# EasyEDA Pro project Restaurant table pager circular.epro, board PCB4
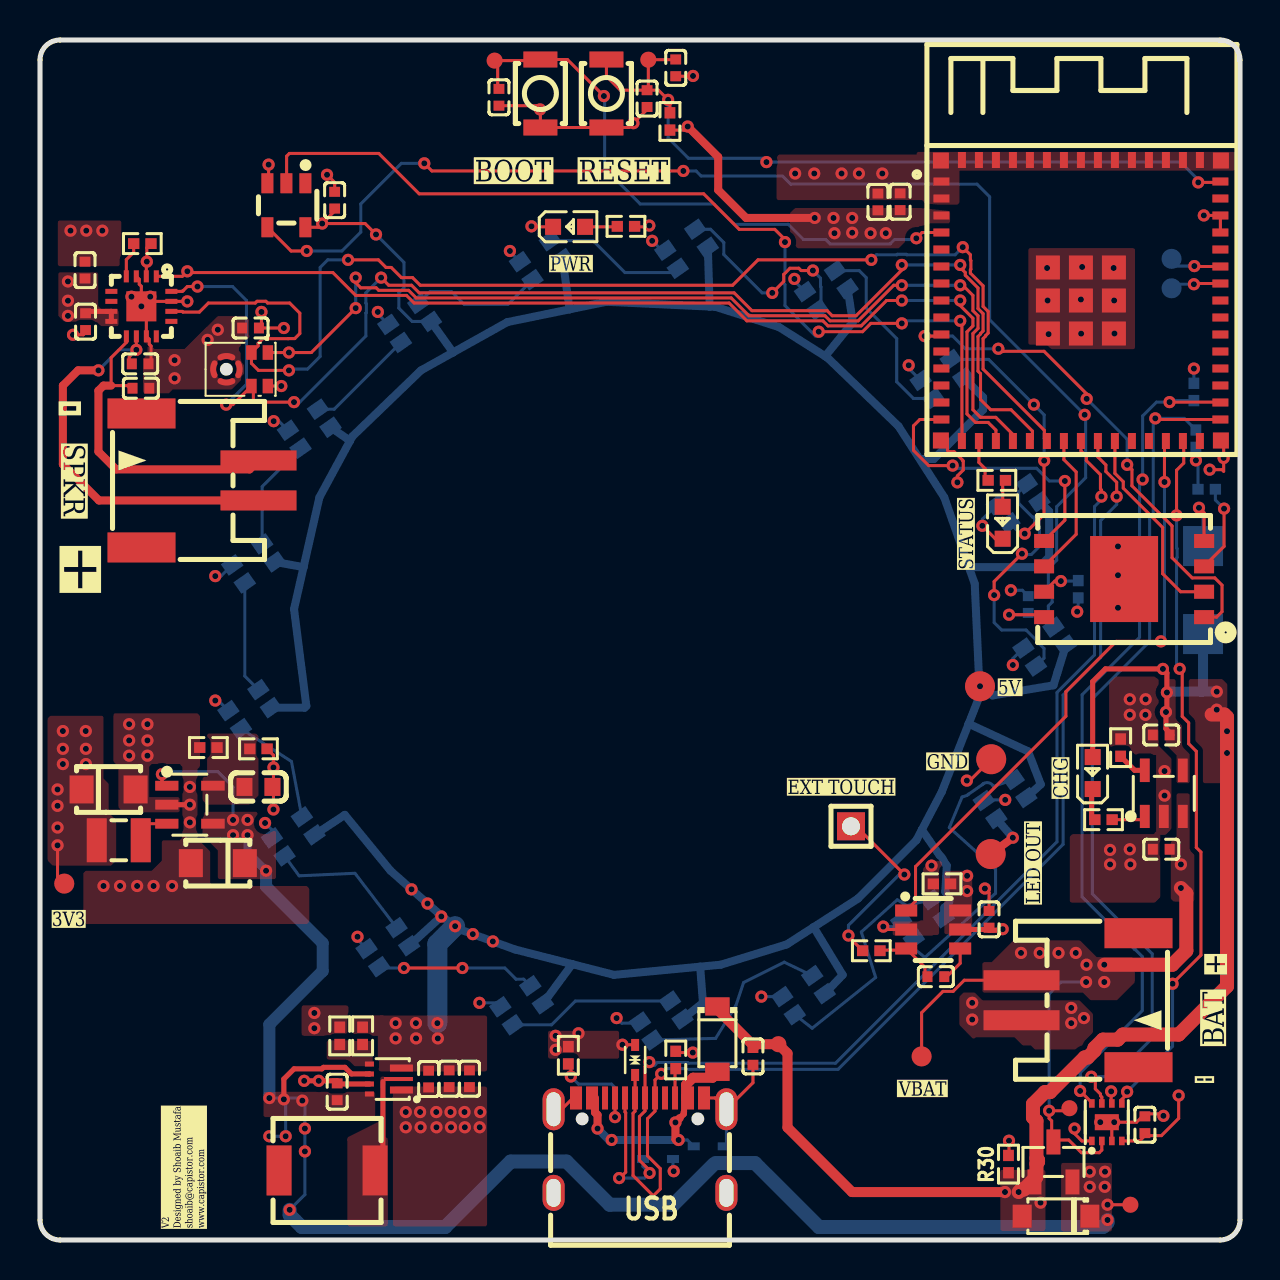
[diagram p1: board, top side]
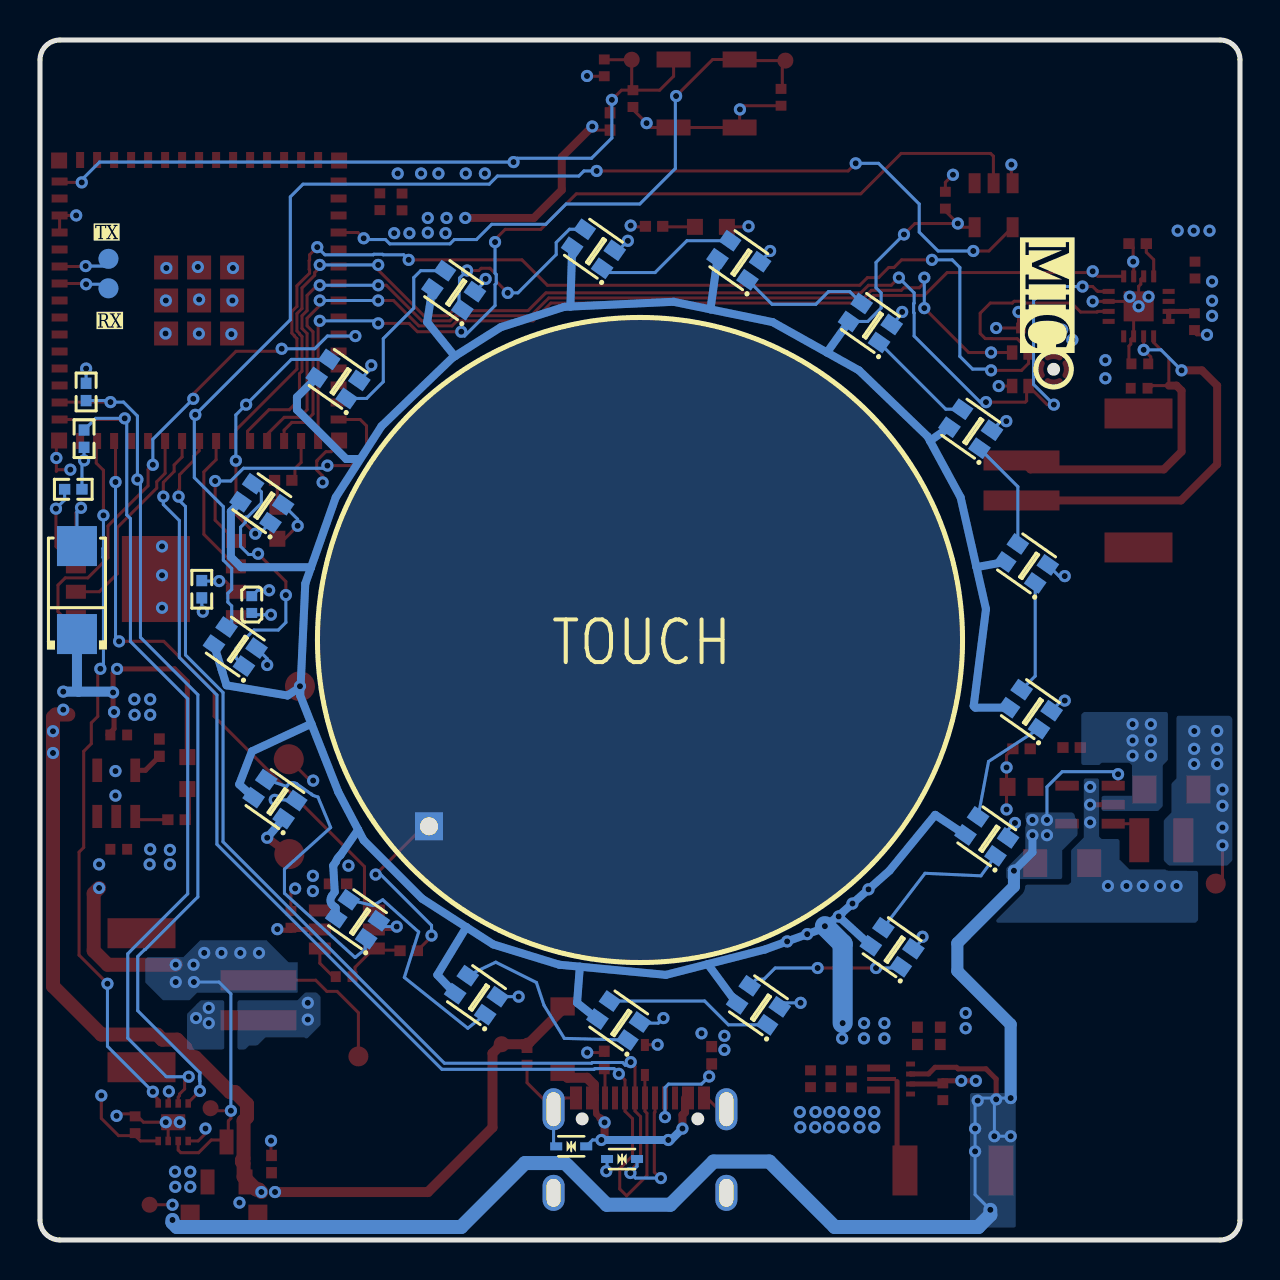
[diagram p2: board, bottom side, seen from below]

Outline 60 x 60 mm; copper layers: Top Layer, Inner1, Inner2, Bottom Layer. Coordinates in mm from the lower left corner of the outline.
Outline path: 0,59 0,1 arc(0.29,0.29) 1,0 59,0 arc(59.71,0.29) 60,1 60,59 arc(59.71,59.71) 59,60 1,60 arc(0.29,59.71) 0,59
Stack: Top Layer 0.035mm Outer layer thickness 1oz / Dielectric1 0.2104mm 7628 RC49% 8.6mil / Inner1 0.0152mm Inner layer thickness / Dielectric2 1.065mm 1.1mm H/HOZ Copper / Inner2 0.0152mm Inner layer thickness / Dielectric3 0.2104mm 7628 RC49% 8.6mil / Bottom Layer 0.035mm Outer layer thickness 1oz

## Design rules (mm)
net D-: DP1
net D+: DP1
template: Custom Config
spacing copperThickness1oz (default): track to track 0.102, other pairs 0.152 to 0.3
spacing copperThickness2oz: track to track 0.203, other pairs 0.152 to 0.3
track width copperThickness1oz (default): min 0.127, default 0.152, max 2.54
track width copperThickness2oz: min 0.203, default 0.254, max 2.54
differential pair differentialPair (default): width min 0.127, default 0.152, max 2.54; gap min 0.152, default 0.152
via viaSize (default): diameter min 0.5, default 0.61, max 10; hole min 0.3, default 0.305, max 6.3
net +5V uses copperRegion1
net $1N5564 uses copperRegion1
net $1N5430 uses copperRegion1
net $1N5433 uses copperRegion1

## Placement (name value [footprint] x y rotation side)
C1  10uF  [CAP-SMD_L3.2-W1.6]  3.43 22.53 0 top
C2  22pF  [C0603]  10.92 22.65 0 top
C3  10uF  [CAP-SMD_L3.2-W1.6]  8.89 18.84 180 top
C4  10uF  [C0402]  41.9 51.9 270 top
C7  22uF  [C0402]  19.43 8.05 270 top
C8  4.7uF  [C0402]  56.06 19.54 180 top
C9  4.7uF  [C0402]  56.06 25.25 180 top
C10  10uF  [C0402]  14.86 7.41 270 top
C12  100nF  [C0402]  14.73 51.99 270 top
C14  100nF  [C0402]  43.01 51.91 270 top
C15  100nF  [C0402]  30.35 57.07 270 top
C17  100nF  [C0402]  10.53 45.6 0 top
C18  10nF  [C0402]  44.79 13.17 180 top
C20  100nF  [C0402]  47.45 16.03 270 top
C21  100nF  [C0402]  55.24 5.76 270 top
C22  10uF  [C0402]  2.25 48.5 270 top
C23  100nF  [C0402]  2.28 45.92 90 top
C24  220pF  [C0402]  5.01 43.81 180 top
C25  220pF  [C0402]  5.04 42.59 180 top
C39  22uF  [C0402]  20.46 8.06 270 top
C40  22uF  [C0402]  21.47 8.06 270 top
C41  10uF  [C0402]  35.65 9.18 90 top
C42  1uF  [C0402]  31.79 58.61 90 top
C43  100nF  [C0402]  22.95 57.13 270 top
C44  100nF  [C0402]  49.41 31.77 90 bottom
CN1  S2B-PH-SM4-TB(LF)(SN)  [CONN-SMD_P2.00_S2B-PH-SM4-TB-LF-SN]  52 11.99 90 top
D1  B5819W  [SOD-123_L2.8-W1.8-LS3.7-RD]  50.8 1.19 180 top
D4  LESD5D5.0CT1G  [SOD-523_L1.2-W0.8-LS1.6-BI]  29.75 9 270 top
D5  LESD5D5.0CT1G  [SOD-523_L1.2-W0.8-LS1.6-BI]  30.9 4.05 180 bottom
D6  LESD5D5.0CT1G  [SOD-523_L1.2-W0.8-LS1.6-BI]  33.44 4.68 180 bottom
D7  1N5819HW-7-F  [SOD-123_L2.7-W1.6-LS3.7-RD]  33.87 10.04 270 top
D8  SMAJ5.0A  [SMA_L4.3-W2.6-LS5.1-RD]  58.15 32.5 90 bottom
DO1  -  [Test-Point-0.5mm#2]  47.53 19.3 0 top
GND1  -  [Test-Point-0.5mm#2]  47.56 24.04 0 top
H1  speaker  [CONN-SMD_P2.00_S2B-PH-SM4-TB-LF-SN]  8 37.98 270 top
H2  -  [HDR-TH_1P-V-M_XKB_X4611WV-01I-C28D40]  40.55 20.69 180 top
L1  2.2uH  [IND-SMD_L2.5-W2.0_MHCHL2520]  3.94 19.99 0 top
L2  1uH  [IND-SMD_L5.4-W5.1]  14.35 3.48 180 top
LED1  WS2812B-2020  [LED-SMD_4P-L2.0-W2.0-TL_WS2812B-2020]  48.25 22.05 35 bottom
LED2  WS2812B-2020  [LED-SMD_4P-L2.0-W2.0-TL_WS2812B-2020]  44.12 16.04 35 bottom
LED3  WS2812B-2020  [LED-SMD_4P-L2.0-W2.0-TL_WS2812B-2020]  38.18 12.24 35 bottom
LED4  WS2812B-2020  [LED-SMD_4P-L2.0-W2.0-TL_WS2812B-2020]  31.06 10.97 35 bottom
LED5  KT-0603R  [LED0603-RD]  52.63 23.35 90 top
LED6  WS2812B-2020  [LED-SMD_4P-L2.0-W2.0-TL_WS2812B-2020]  24.08 11.73 35 bottom
LED7  WS2812B-2020  [LED-SMD_4P-L2.0-W2.0-TL_WS2812B-2020]  17.39 14.64 35 bottom
LED8  WS2812B-2020  [LED-SMD_4P-L2.0-W2.0-TL_WS2812B-2020]  12.66 20.18 35 bottom
LED9  WS2812B-2020  [LED-SMD_4P-L2.0-W2.0-TL_WS2812B-2020]  10.48 26.54 35 bottom
LED10  WS2812B-2020  [LED-SMD_4P-L2.0-W2.0-TL_WS2812B-2020]  10.67 33.83 35 bottom
LED11  WS2812B-2020  [LED-SMD_4P-L2.0-W2.0-TL_WS2812B-2020]  13.46 40.56 35 bottom
LED12  WS2812B-2020  [LED-SMD_4P-L2.0-W2.0-TL_WS2812B-2020]  18.48 45.85 35 bottom
LED13  WS2812B-2020  [LED-SMD_4P-L2.0-W2.0-TL_WS2812B-2020]  25.06 48.99 35 bottom
LED14  WS2812B-2020  [LED-SMD_4P-L2.0-W2.0-TL_WS2812B-2020]  32.33 49.56 35 bottom
LED15  WS2812B-2020  [LED-SMD_4P-L2.0-W2.0-TL_WS2812B-2020]  39.32 47.49 35 bottom
LED16  KT-0603R  [LED0603-RD]  48.13 35.86 90 top
LED17  WS2812B-2020  [LED-SMD_4P-L2.0-W2.0-TL_WS2812B-2020]  45.1 43.05 35 bottom
LED18  WS2812B-2020  [LED-SMD_4P-L2.0-W2.0-TL_WS2812B-2020]  48.91 36.84 35 bottom
LED19  WS2812B-2020  [LED-SMD_4P-L2.0-W2.0-TL_WS2812B-2020]  50.24 29.67 35 bottom
LED21  KT-0603R  [LED0603-RD]  26.45 50.66 0 top
Q1  DMG3415U  [SOT-23-3_L2.9-W1.3-P1.90-LS2.4-BR-1]  50.67 3.9 270 top
R2  100kΩ  [R0402]  10.92 24.56 0 top
R13  732kΩ  [R0402]  16.13 10.21 90 top
R14  100kΩ  [R0402]  14.99 10.21 270 top
R17  10kΩ  [R0402]  57.69 42.4 90 bottom
R18  10kΩ  [R0402]  57.8 40.07 270 bottom
R19  5.1kΩ  [R0402]  31.79 9 270 top
R20  5.1kΩ  [R0402]  26.42 9.24 270 top
R21  10kΩ  [R0402]  31.5 55.93 270 top
R24  10kΩ  [R0402]  41.57 14.46 180 top
R27  0Ω  [R0402]  45.1 17.81 180 top
R28  1kΩ  [R0402]  54.03 24.62 90 top
R30  10kΩ  [R0402]  48.42 3.79 90 top
R32  22.1kΩ  [R0402]  8.42 24.62 180 top
R35  1MΩ  [R0402]  5.12 49.82 180 top
R38  140Ω  [R0402]  53.17 21.02 0 top
R39  140Ω  [R0402]  29.3 50.68 180 top
R40  140Ω  [R0402]  47.84 37.98 0 top
R41  10kΩ  [R0402]  51.91 32.54 90 bottom
R42  10kΩ  [R0402]  58.34 37.54 0 bottom
SW1  B3U-1000P  [KEY-SMD_B3U-1000PM]  28.32 57.32 90 top
SW2  B3U-1000P  [KEY-SMD_B3U-1000PM]  25.02 57.32 90 top
TP1  -  [Test-Point-0.5mm#2]  47 27.69 0 top
TP3  -  [Test-Point-0.5mm]  56.58 47.58 180 bottom
TP4  -  [Test-Point-0.5mm#3]  22.73 58.97 0 top
TP5  -  [Test-Point-0.5mm#3]  30.42 59.01 0 top
TP6  -  [Test-Point-0.5mm#3]  54.52 1.76 0 top
TP7  -  [Test-Point-0.5mm#3]  36.92 9.79 0 top
TP8  -  [Test-Point-0.5mm#3]  51.47 6.59 0 top
TP9  -  [Test-Point-0.5mm]  1.21 17.82 0 top
TP10  -  [Test-Point-0.5mm]  56.58 49.06 180 bottom
TP11  -  [Test-Point-0.5mm]  44.08 9.18 0 top
U1  SY8088IAAC  [SOT-23-5_L3.0-W1.7-P0.95-LS2.8-BL]  7.49 21.76 270 top
U3  MCP73831T-2ACI/OT  [SOT-23-5_L3.0-W1.7-P0.95-LS2.8-BL]  56.19 22.33 0 top
U4  TPS61022RWUR  [VQFN-7_L2.0-W2.0-P0.55-TL_RWU]  17.27 8.05 180 top
U5  ESP32-S3-MINI-1-N4R2  [BULETM-SMD_ESP32-S3-MINI-1-N8]  52.04 46.97 0 top
U6  SN74LV1T34DBVR  [SOT-23-5_L2.9-W1.6-P0.95-LS2.8-BR_2]  12.32 51.74 90 top
U7  MAX98357AETE+T  [TQFN-16_L3.0-W3.0-P0.50-BL-EP1.5]  5.07 46.68 180 top
U8  SPH0655LM4H-1-8  [MIC-SMD_SPH0655LM4H-1-8]  10.02 43.54 270 top
U9  MAX17048G+T10  [TDFN-8_L2.0-W2.0-P0.50-BL-EP1.2]  53.34 5.89 0 top
U10  AT42QT1011-TSHR  [SOT-23-6_L2.9-W1.6-P0.95-LS2.8-BR]  44.66 15.53 180 top
U12  MX35LF1GE4AB-Z4ITR  [WSON-8_L8.0-W6.0-P1.27-TL-1]  54.2 33.05 180 top
USB1  USB4105-GF-A  [TYPE-C-SMD_SBC-160S1A-20-S412]  30 4.73 0 top

## Footprints (pads in the part's own frame, mm; a bottom-side part is the same pattern mirrored in y, then rotated)
BULETM-SMD_ESP32-S3-MINI-1-N8
  rect 0.8x0.4 smd: 1(-6.975,5.95) 2(-6.975,5.1) 3(-6.975,4.25) 4(-6.975,3.4) 5(-6.975,2.55) 6(-6.975,1.7) 7(-6.975,0.85) 8(-6.975,0) 9(-6.975,-0.85) 10(-6.975,-1.7) 11(-6.975,-2.55) 12(-6.975,-3.4) 13(-6.975,-4.25) 14(-6.975,-5.1) 15(-6.975,-5.95) 31(6.975,-5.95) 32(6.975,-5.1) 33(6.975,-4.25) 34(6.975,-3.4) 35(6.975,-2.55) 36(6.975,-1.7) 37(6.975,-0.85) 38(6.975,0) 39(6.975,0.85) 40(6.975,1.7) 41(6.975,2.55) 42(6.975,3.4) 43(6.975,4.25) 44(6.975,5.1) 45(6.975,5.95)
  rect 0.4x0.8 smd: 16(-5.95,-7.025) 17(-5.1,-7.025) 18(-4.25,-7.025) 19(-3.4,-7.025) 20(-2.55,-7.025) 21(-1.7,-7.025) 22(-0.85,-7.025) 23(0,-7.025) 24(0.85,-7.025) 25(1.7,-7.025) 26(2.55,-7.025) 27(3.4,-7.025) 28(4.25,-7.025) 29(5.1,-7.025) 30(5.95,-7.025) 46(5.95,7.025) 47(5.1,7.025) 48(4.25,7.025) 49(3.4,7.025) 50(2.55,7.025) 51(1.7,7.025) 52(0.85,7.025) 53(0,7.025) 54(-0.85,7.025) 55(-1.7,7.025) 56(-2.55,7.025) 57(-3.4,7.025) 58(-4.25,7.025) 59(-5.1,7.025) 60(-5.95,7.025)
  rect 0.8x0.8 smd: GND(-7,7) GND(-7,-7) GND(7,7) GND(7,-7)
  rect 1.2x1.2 smd: GND(-1.65,1.65) GND(-1.65,0) GND(-1.65,-1.65) GND(0,1.65) GND(0,0) GND(0,-1.65) GND(1.65,1.65) GND(1.65,0) GND(1.65,-1.65)
C0402
  rect 0.5x0.54 smd: 1(-0.42,0) 2(0.42,0)
C0603
  rect 0.8x0.9 smd: 1(-0.7,0) 2(0.7,0)
CAP-SMD_L3.2-W1.6
  rect 1.2x1.4 smd: 1(-1.35,0) 2(1.35,0)
CONN-SMD_P2.00_S2B-PH-SM4-TB-LF-SN
  rect 1x3.8 smd: 1(-1,2.925) 2(1,2.925)
  rect 1.5x3.4 smd: 3(3.35,-2.925) 4(-3.35,-2.925)
HDR-TH_1P-V-M_XKB_X4611WV-01I-C28D40
  rect 1.4x1.4 hole 0.9: 1(0,0)
IND-SMD_L2.5-W2.0_MHCHL2520
  rect 1x2.2 smd: 1(-1.1,0) 2(1.1,0)
IND-SMD_L5.4-W5.1
  rect 1.25x2.5 smd: 1(-2.4,0) 2(2.4,0)
KEY-SMD_B3U-1000PM
  rect 0.8x1.7 smd: 1(-1.7,0) 2(1.7,0)
LED0603-RD
  rect 0.8x0.8 smd: 1(-0.799,0) 2(0.799,0)
LED-SMD_4P-L2.0-W2.0-TL_WS2812B-2020
  rect 0.9x0.7 smd: 1(-0.915,0.55) 2(-0.915,-0.55) 3(0.915,-0.55) 4(0.915,0.55)
MIC-SMD_SPH0655LM4H-1-8
  rect 0.725x0.522 smd: 1(-0.838,1.368) 2(-0.838,0.546) 4(0.838,0.546) 5(0.838,1.368)
  custom 0.37x0.892 smd: 3(-0.662,-0.706)
  custom 0.892x0.37 smd: 3(0,-0.043) 3(0,-1.368)
  custom 0.37x0.893 smd: 3(0.662,-0.706)
R0402
  rect 0.566x0.54 smd: 1(-0.433,0) 2(0.433,0)
SMA_L4.3-W2.6-LS5.1-RD
  rect 2x2 smd: 1(-2.2,0) 2(2.2,0)
SOD-123_L2.7-W1.6-LS3.7-RD
  rect 0.91x1.22 smd: 1(-1.635,0) 2(1.635,0)
SOD-123_L2.8-W1.8-LS3.7-RD
  rect 0.95x1.15 smd: 1(-1.692,0) 2(1.692,0)
SOD-523_L1.2-W0.8-LS1.6-BI
  rect 0.6x0.4 smd: 1(-0.75,0) 2(0.75,0)
SOT-23-3_L2.9-W1.3-P1.90-LS2.4-BR-1
  rect 1.25x0.7 smd: 1(1,-0.95) 2(1,0.95) 3(-1,0)
SOT-23-5_L2.9-W1.6-P0.95-LS2.8-BR_2
  rect 1x0.6 smd: 1(1.1,-0.95) 2(1.1,0) 3(1.1,0.95) 4(-1.1,0.95) 5(-1.1,-0.95)
SOT-23-5_L3.0-W1.7-P0.95-LS2.8-BL
  rect 0.49x1.157 smd: 1(-0.95,-1.153) 2(0,-1.153) 3(0.95,-1.153)
  rect 0.49x1.175 smd: 4(0.95,1.153) 5(-0.95,1.153)
SOT-23-6_L2.9-W1.6-P0.95-LS2.8-BR
  rect 1.1x0.6 smd: 1(1.35,-0.95) 2(1.35,0) 3(1.35,0.95) 4(-1.35,0.95) 5(-1.35,0) 6(-1.35,-0.95)
TDFN-8_L2.0-W2.0-P0.50-BL-EP1.2
  rect 0.28x0.425 smd: 1(-0.75,-0.938) 2(-0.25,-0.938) 3(0.25,-0.938) 4(0.75,-0.938) 5(0.75,0.938) 6(0.25,0.938) 7(-0.25,0.938) 8(-0.75,0.938)
  rect 1.2x0.8 smd: 9(0,0)
Test-Point-0.5mm
  round 1 smd: 1(0,0)
Test-Point-0.5mm#2
  round 1.5 smd: 1(0,0)
Test-Point-0.5mm#3
  round 0.8 smd: 1(0,0)
TQFN-16_L3.0-W3.0-P0.50-BL-EP1.5
  rect 0.25x0.6 smd: 1(-0.749,-1.5) 2(-0.248,-1.5) 3(0.252,-1.5) 4(0.751,-1.5) 9(0.75,1.5) 10(0.25,1.5) 11(-0.25,1.5) 12(-0.749,1.5)
  rect 0.6x0.25 smd: 5(1.5,-0.748) 6(1.5,-0.248) 7(1.5,0.252) 8(1.5,0.752) 13(-1.5,0.752) 14(-1.5,0.252) 15(-1.5,-0.248) 16(-1.5,-0.748)
  rect 1.5x1.5 smd: 17(0,0)
TYPE-C-SMD_SBC-160S1A-20-S412
  oval 1.1x2.1 hole 0.7x1.7: 1(-4.32,1.807) 1(4.32,1.807)
  oval 1.1x1.8 hole 0.7x1.4: 1(-4.32,-2.373) 1(4.32,-2.373)
  rect 0.3x1.15 smd: A1(-3.35,2.372) A4(-2.55,2.372) A5(-1.25,2.372) A6(-0.25,2.372) A7(0.25,2.372) A8(1.25,2.373) A9(2.55,2.373) A12(3.35,2.372) B1(3.05,2.372) B4(2.25,2.373) B5(1.75,2.372) B6(0.75,2.372) B7(-0.75,2.372) B8(-1.75,2.373) B9(-2.25,2.372) B12(-3.05,2.372)
VQFN-7_L2.0-W2.0-P0.55-TL_RWU
  rect 1.15x0.35 smd: 1(-0.8,0.55) 3(-0.8,-0.55)
  rect 1.45x0.2 smd: 2(-0.65,0)
  rect 0.45x0.25 smd: 4(0.8,-0.75) 5(0.8,-0.25) 6(0.8,0.25) 7(0.8,0.75)
WSON-8_L8.0-W6.0-P1.27-TL-1
  rect 1x0.7 smd: 1(-4,1.905) 2(-4,0.635) 3(-4,-0.635) 4(-4,-1.905) 5(4,-1.905) 6(4,-0.635) 7(4,0.635) 8(4,1.905)
  rect 3.4x4.3 smd: 9(0,0)

## Nets
As in the schematic, except:
GND: C1.2 C3.2 C4.1 C7.2 C8.2 C9.2 C10.1 C12.1 C14.1 C15.2 C17.1 C20.1 C21.2 C22.1 C23.1 C24.1 C25.1 C39.2 C40.2 C41.1 C42.1 C43.2 C44.2 CN1.1 D4.1 D5.1 D6.1 D8.2 GND1.1 LED1.2 LED2.2 LED3.2 LED4.2 LED6.2 LED7.2 LED8.2 LED9.2 LED10.2 LED11.2 LED12.2 LED13.2 LED14.2 LED15.2 LED16.1 LED17.2 LED18.2 LED19.2 LED21.1 R14.1 R19.1 R20.1 R27.2 R28.2 R30.2 R32.2 SW1.1 SW2.1 U1.2 U3.2 U4.1 U4.6 U5.1 U5.2 U5.42 U5.43 U5.46 U5.47 U5.48 U5.49 U5.50 U5.51 U5.52 U5.53 U5.54 U5.55 U5.56 U5.57 U5.58 U5.59 U5.60 U5.GND U6.3 U7.3 U7.11 U7.15 U7.17 U8.3 U9.1 U9.4 U9.6 U10.2 U12.4 U12.9 USB1.1 USB1.A1 USB1.A12 USB1.B1 USB1.B12
CC1: R20.2 USB1.A5
CC2: R19.2 USB1.B5
D+: D4.2 U5.24 USB1.A6 USB1.B6
D-: D5.2 U5.23 USB1.A7 USB1.B7
$1N5565: D6.2 D7.2 USB1.A4 USB1.A9 USB1.B4 USB1.B9

Pads without a net: CN1 3 4; H1 3 4; U5 5 6 7 8 9 11 12 13 14 26 27 30 33 34 35 36 37 38 41 44; U6 1; U7 5 6 12 13; USB1 A8 B8

## Via types
v1: diameter 0.61, hole 0.305, Top Layer to Bottom Layer, 288 vias

## Routing (per net, layer and track width the routed paths; a pad name or vN(x,y) marks a point on that pad's centre or on a via; arc(x,y) is an arc through that point)
3V3: length 34.4
  Top Layer w0.152: U9.3 53.59,5.64 U9.9 ; U8.5 v1(12.07,42.7) ; R35.1 5.34,49.61 v1(5.34,48.92) 5.32,48.89 U7.2 ; R2.2 11.67,24.24 v1(11.67,23.63) 11.67,22.6 ; 29.81,50.66 30.4,50.66 v1(30.47,50.72) ; v1(56.17,6.21) 56.07,6.31 55.24,6.31 54.83,5.89 v1(53.71,5.89) ; U12.8 50.08,31.26 v1(48.45,31.26) ; v1(12.19,45.6) 11.07,45.6 v1(11.07,46.4) ; R21.2 32.21,55.49 v1(32.39,55.67) ; 0.91,17.87 0.88,17.9 v1(0.88,19.73) ; 11.67,22.6 C2.2 ; 11.67,22.6 v1(11.67,21.53)
  Top Layer w0.254: v1(48.13,15.54) 48.08,15.49 47.45,15.49 47.42,15.53 U10.5 ; U7.8 U7.7 2.37,46.43 C23.2
  Top Layer w0.4: v1(32.39,55.67) 33.91,54.15 33.91,52.5 35.31,51.1 v1(38.73,51.1)
  Bottom Layer w0.152: C44.1 49.32,31.26 v1(48.45,31.26) ; R18.2 v1(57.8,38.98) 57.9,38.87 R42.1 ; R17.2 v1(57.69,43.57) ; v1(51.86,31.42) 51.91,31.47 R41.1
  vias: v1(0.88,22.53) v1(0.88,21.71) v1(0.88,20.62) v1(1.14,25.45) v1(1.14,24.56) v1(1.14,23.8) v1(1.4,47.93) v1(1.4,46.96) v1(1.4,46.21) v1(2.29,25.45) v1(2.29,24.56) v1(2.29,23.8) v1(39.67,51.1) v1(39.72,50.34) v1(40.61,51.1) v1(40.61,50.36) v1(41.53,50.34) v1(42.29,50.34) v1(46.36,18.21) v1(46.36,17.45) v1(53.01,5.89)
+5V: length 177.5
  Top Layer w0.152: U6.5 13.92,50.64 v1(14.11,50.82) ; v1(14.11,50.82) 14.73,51.45 ; v1(14.11,50.82) 16.25,50.82 v1(16.8,50.28)
  Bottom Layer w0.152: LED12.4 18.61,45.93 17.94,46.59 17.94,47.36 18.2,47.61 18.2,48.88 v1(16.8,50.28) ; 44.11,39.05 44.09,39.07
  Bottom Layer w0.4: 39.26,44.19 40.64,45.89 40.38,47.57 ; 39.26,44.19 39.37,44.12 42.93,40.69 45.21,37.13 46.45,33.62 ; 39.26,44.19 36.96,45.64 33.78,46.66 33.48,46.67 ; 26.61,13.79 28.7,13.26 33.01,13.67 ; 26.61,13.79 LED6.4 ; 26.61,13.79 23.75,14.53 v1(22.64,14.93) v1(21.64,15.29) 20.95,15.54 v1(20.76,15.69) 20.12,16.17 ; LED4.4 33.15,11.86 33.01,13.67 ; 46.45,33.62 46.47,33.64 49.95,33.64 50.46,34.15 50.46,36.43 LED18.4 ; 46.45,33.62 46.74,32.81 46.97,27.65 ; 44.09,20.51 45.08,22.4 46.43,25.81 ; 44.09,20.51 44.98,19.24 arc(45.12,19.09) 45.2,18.91 45.34,18.72 45.26,17.41 45.42,17.19 arc(45.47,16.93) 45.33,16.7 45.22,16.62 LED2.4 ; 44.09,20.51 43.82,19.99 40.89,17.07 38.68,15.64 ; 13.18,33.64 13.97,37.13 15.5,39.96 ; 13.18,33.64 12.7,31.54 13.32,26.7 13.23,26.62 11.55,26.62 ; 13.18,33.64 LED10.4 ; 20.65,44.38 23.37,45.89 26.48,46.53 ; 20.65,44.38 19.05,43.48 15.62,40.18 15.5,39.96 ; 20.65,44.38 LED12.4 ; 33.01,13.67 34.04,13.76 37.34,14.78 38.68,15.64 ; 46.43,25.81 49.4,24.43 50.04,22.78 LED1.4 ; 46.43,25.81 46.99,27.23 46.97,27.65 ; 20.12,16.17 19.91,16.32 v1(20.07,16.18) 18.46,14.71 ; 20.12,16.17 v1(19.38,16.82) v1(18.58,17.53) 17.53,18.46 15.24,21.26 LED8.4 ; 38.68,15.64 40.13,13.26 LED3.4 ; 33.48,46.67 28.32,46.91 26.48,46.53 ; 33.48,46.67 33.39,49.64 ; 46.97,27.65 47.63,27.23 50.67,27.73 50.87,28.36 arc(50.89,28.44) 50.92,28.51 51.3,29.75 ; 44.11,39.05 44.69,39.05 47.15,41.51 47.15,42.14 LED17.4 ; 14.53,40.64 15.5,39.96 ; 26.48,46.53 LED13.4
  Bottom Layer w1: v1(20.76,15.69) 19.87,14.8 v1(19.87,10.84)
  vias: v1(17.78,10.84) v1(17.78,10.08) v1(18.8,10.84) v1(18.8,10.08) v1(19.89,10.08) v1(47,27.69)
GND: length 74.8
  Top Layer w0.152: USB1.A1 26.08,6.54 USB1.1 ; 2.28,45.37 2.16,45.26 v1(1.65,45.26) ; D4.1 29.74,9.76 v1(29.12,9.76) ; 35.65,8.76 35.65,7.86 USB1.1 33.75,7.1 USB1.A12 ; v1(57.95,36.61) 58.2,36.36 U12.4 ; LED16.1 47.76,35.06 v1(47.12,35.71) ; v1(56.93,7.22) 56.93,6.08 56.07,5.22 55.24,5.22 54.98,4.95 U9.4 ; v1(14.35,53.26) 14.73,52.88 14.73,52.54 ; v1(7.37,46.93) U7.15 5.75,46.93 v1(5.51,47.16) ; v1(58.19,51.23) 59.02,51.23 U5.43 U5.42 ; v1(53.56,7.43) 53.56,6.86 U9.6 ; v1(24.57,50.68) 24.6,50.66 LED21.1 ; C42.1 32.64,58.19 v1(32.65,58.2) ; U10.2 42.31,15.53 v1(42.16,15.67) ; U5.GND 59.18,39.84 v1(59.18,39.1) 59.18,38.44 59.1,38.52 v1(58.48,38.52) ; U7.3 4.96,48.04 4.96,47.79 5.07,47.68 U7.17 5.32,46.43 U7.11 5.46,45.04 5.46,44.79 5.55,44.7 5.55,43.81 ; U6.3 11.43,52.9 v1(11.43,53.77) ; U9.1 52.09,4.95 51.73,5.32 v1(51.73,5.57) ; v1(48.45,4.96) 48.45,4.25 R30.2 ; v1(47.24,17.57) 47.45,17.37 47.45,16.58 ; U5.GND 45.04,40.08 45.12,40.15 45.27,40.15 45.38,40.04 45.38,39.48 45.44,39.42 45.7,39.42 46.14,38.98 46.14,38.97 46.16,38.94 46.16,38.5 45.87,38.21 v1(45.87,37.88) ; GND1.1 46.49,22.97 v1(46.34,22.97) ; v1(32.64,9.37) 31.88,9.37 31.75,9.24 ; C43.2 24.82,56.71 v1(25,56.53) 25.02,56.51 SW2.1 SW1.1 29.45,55.62 v1(29.67,55.84) 30.35,56.53
  Top Layer w0.254: U4.6 15.02,7.8 14.86,7.96 v1(13.94,7.96) v1(13.21,7.96) ; 6.34,21.76 v1(7.49,21.76)
  Bottom Layer w0.152: v1(30.61,49.96) 31.08,49.49 31.26,49.49 ; LED12.2 16.89,46.3 v1(16.89,46.4) ; v1(37.72,48.05) 37.72,47.95 LED15.2 ; LED17.2 43.43,43.58 v1(43.43,43.74) ; C44.2 49.12,32.49 v1(48.54,32.49) ; v1(48.64,28.75) 48.64,29.07 LED19.2 ; 16.33,14.56 15.88,15.02 v1(15.88,15.16) ; LED3.2 v1(36.07,12.17) ; LED13.2 23.49,49.42 v1(23.49,49.45) ; v1(8.76,26.97) 8.91,26.97 9.42,26.47 ; v1(21.97,11.86) 22.82,11.86 LED6.2 ; LED18.2 47.12,36.04 v1(47.12,35.71) ; 12.4,40.49 11.95,40.94 v1(11.68,40.94) ; v1(8.76,33.19) 9.05,33.19 LED10.2 ; LED2.2 42.76,15.67 v1(42.16,15.67) ; LED4.2 29.94,10.84 29.08,10.84 v1(28.83,11.1) ; D6.1 34.32,4.82 USB1.1 ; D8.2 58.15,36.41 v1(57.95,36.61) ; v1(11.25,20.85) 11.6,20.51 LED8.2 ; D5.1 31.65,3.48 v1(31.69,3.44) ; v1(48.26,22.01) 47.22,22.01 LED1.2
  vias: v1(1.52,50.47) v1(2.31,50.47) v1(3.12,50.47) v1(3.17,17.7) v1(4,17.7) v1(4.46,25.79) v1(4.46,24.98) v1(4.46,24.22) v1(4.57,47.16) v1(4.86,17.7) v1(5.07,46.68) v1(5.37,25.79) v1(5.37,24.98) v1(5.37,24.22) v1(5.68,17.7) v1(6.6,17.7) v1(6.73,43.99) v1(6.73,43.09) v1(7.49,22.65) v1(7.49,20.88) v1(8.38,45.01) v1(8.89,45.51) v1(13.72,11.35) v1(13.72,10.59) v1(18.29,6.4) v1(18.29,5.64) v1(19,6.4) v1(19.03,5.64) v1(19.81,6.4) v1(19.82,5.64) v1(20.52,6.4) v1(20.55,5.64) v1(21.23,6.4) v1(21.24,5.64) v1(22.01,6.4) v1(21.98,5.64) v1(25.78,10.21) v1(25.78,9.51) v1(26.92,10.33) v1(37.76,53.32) v1(38.71,53.32) v1(40.08,53.32) v1(40.95,53.32) v1(42.11,53.32) v1(44.58,18.72) v1(46.61,11.86) v1(46.61,11.02) v1(50.35,48.6) v1(50.38,46.97) v1(50.43,45.29) v1(51.56,11.6) v1(51.56,10.84) v1(52.04,47.03) v1(52.06,45.32) v1(52.11,48.65) v1(52.2,11.1) v1(53.5,19.51) v1(53.5,18.78) v1(53.68,48.6) v1(53.71,46.97) v1(53.72,45.32) v1(53.9,34.68) v1(53.9,33.24) v1(53.9,31.61) v1(54.49,27.04) v1(54.49,26.26) v1(54.49,19.54) v1(54.52,18.78) v1(55.28,27.04) v1(55.27,26.26) v1(56.23,23.45) v1(56.23,22.22)
VBAT: length 29.4
  Top Layer w0.152: Q1.3 50.58,4.99 50.58,5.95 50.46,6.08 v1(50.46,6.46) 51.34,6.46 TP8.1 ; TP11.1 44.08,11.36 45.15,12.43 45.66,12.43 46.21,12.99 CN1.2 ; 50.67,5.16 50.83,5 51.44,5 52.07,4.37 52.96,4.37 53.09,4.5 U9.2
  Top Layer w0.7: v1(57.04,17.6) 57.32,17.33 57.32,14.46 56.62,13.76 v1(53.21,13.76)
  Bottom Layer w0.152: v1(52.3,12.9) 51.05,12.9 50.46,12.3 v1(50.46,6.46)
  vias: v1(49.05,14.35) v1(49.98,14.35) v1(50.93,14.35) v1(51.79,14.35) v1(52.32,13.76) v1(53.21,12.9) v1(57.04,18.78)
VBUS: length 68.4
  Top Layer w0.254: LED5.2 52.63,27.92 53.27,28.55 v1(56.15,28.55) 56.35,28.35 v1(56.35,27.38) 56.35,26.45 v1(56.3,26.4) 56.3,25.56 56.61,25.25
  Top Layer w0.5: 35.65,9.86 35.53,9.86 33.87,11.53 ; C41.2 35.84,9.79 TP7.1 37.37,9.33 37.37,5.62 40.6,2.4 v1(48.25,2.4)
  Top Layer w0.7: v1(48.93,2.4) 49.06,2.53 49.19,2.53 49.82,3.16 49.82,3.83 49.9,3.91 49.9,3.99 49.82,4.07 49.82,5.96 49.65,6.13 49.65,6.8 50.25,7.4 50.5,7.4 52.23,9.13 52.38,9.13 52.72,9.47 52.72,9.6 53.14,10.02 53.88,10.02 54.14,10.27 56.93,10.27 59.35,12.69 v1(59.35,24.35) v1(59.35,25.44) 59.35,26.14 59.22,26.27 58.58,26.27
  Bottom Layer w0.5: 58.07,27.42 56.39,27.42 v1(56.35,27.38) ; 58.07,27.42 58.15,27.5 D8.1 ; 58.07,27.42 v1(58.84,27.42)
  vias: v1(50.03,1.87) v1(58.84,26.51)
BM_ALRT: length 35.5
  Top Layer w0.152: v1(56.83,36.23) 56.83,38.49 57.19,38.85 57.19,39.91 U5.29 ; v1(56.98,28.56) 57.11,28.43 57.11,26.18 57.43,25.86 57.43,24.82 57.82,24.43 57.82,19.63 58.05,19.39 58.05,14.24 56.83,13.03 56.83,13.01 v1(56.63,12.81) ; v1(54.36,7.41) 54.34,7.25 54.22,7.16 54.09,7.03 U9.5
  Bottom Layer w0.152: v1(56.83,36.23) 56.83,34.6 56.86,34.57 56.86,34.13 56.83,34.1 56.83,28.72 v1(56.98,28.56) ; v1(56.63,12.81) 56.63,9.69 v1(54.36,7.41)
BOOT: length 30
  Top Layer w0.152: 45.07,50.38 44.1,50.38 v1(43.82,50.09) ; C43.1 22.95,57.71 22.88,57.77 22.88,58.82 TP4.1 24.96,58.97 SW2.2 26.37,59.02 v1(28.19,57.2)
  Bottom Layer w0.152: v1(28.19,57.2) 28.19,57.17 28.23,57.13 28.23,53.58 30.01,51.8 33.69,51.8 34.71,50.78 37.41,50.78 38.17,50.02 39.29,50.02 39.5,49.81 42.51,49.81 42.73,50.02 43.54,50.02 43.6,50.09 v1(43.82,50.09)
CC1: length 5.6
  Top Layer w0.152: USB1.A5 v1(28.75,6.14) ; 26.42,8.8 26.54,8.68 v1(26.54,8.18)
  Bottom Layer w0.152: v1(26.54,8.18) 26.92,7.79 28.58,7.79 28.75,7.62 v1(28.75,6.14)
CC2: length 1.3
  Top Layer w0.152: 31.75,8.38 USB1.B5
D+: length 59.9
  Top Layer w0.152: v1(53.83,37.17) 53.83,37.88 53.29,38.42 53.29,38.75 52.89,39.15 U5.24 ; D4.2 29.75,7.11 USB1.A6 29.75,6.44 29.65,6.34 29.65,3.22 30.67,2.21 31.01,2.55 31.01,3.57 30.37,4.21 30.37,6.07 30.75,6.44 USB1.B6 30.75,8 v1(31.06,8.31)
  Bottom Layer w0.152: v1(31.06,8.31) 31.06,8.34 31.29,8.57 32.26,8.57 32.29,8.53 39.9,8.53 51.15,19.78 51.15,27.25 53.03,29.13 53.03,35.97 53.83,36.77 v1(53.83,37.17)
D-: length 59.1
  Top Layer w0.152: v1(28.96,3.1) 28.99,3.1 29.28,3.39 29.28,6.36 29.25,6.4 USB1.B7 ; v1(30.48,3.35) 30.48,3.48 29.97,3.98 29.97,6.17 30.25,6.45 USB1.A7 30.25,8.68 v1(30.47,8.89) ; U5.23 52.04,39.46 52.32,39.19 52.32,38.97 53.02,38.27 53.02,37.55 53.07,37.5 v1(53.07,37.17)
  Bottom Layer w0.152: v1(53.07,37.17) 53.07,37.02 52.73,36.67 52.73,29.25 50.85,27.38 50.85,19.91 39.78,8.84 32.42,8.84 32.38,8.88 30.87,8.88 30.74,8.74 30.62,8.74 v1(30.47,8.89) ; D5.2 30.15,3.68 v1(30.48,3.35) 30.23,3.1 v1(28.96,3.1)
DIN_LED: length 64.5
  Top Layer w0.152: v1(32.17,53.45) 19.59,53.45 v1(19.21,53.83) ; v1(13.33,49.45) 12.55,49.45 U6.4
  Bottom Layer w0.152: LED19.3 50.42,30.9 50.42,31.7 50.61,31.89 50.61,32.34 50.42,32.53 50.42,33.57 50.83,33.99 50.83,36.67 52.28,38.12 52.28,41.26 ; v1(32.17,53.45) 32.8,53.45 33.06,53.2 37.13,53.2 37.53,52.79 46.85,52.79 47.48,52.16 47.48,46.01 v1(52.23,41.26) ; v1(19.21,53.83) 18.07,53.83 16.04,51.8 16.04,50.4 15.09,49.45 v1(13.33,49.45)
LED_BUF: length 47.3
  Top Layer w0.152: v1(37.25,49.9) 37.25,50.02 36.74,50.53 34.96,50.53 33.18,52.31 18.96,52.31 16.94,54.33 12.47,54.33 12.33,54.19 12.33,52.85 U6.2 ; v1(38.94,45.41) 41.13,45.41 41.54,45.83 v1(43.09,45.83) ; U5.16 46.09,45.88 v1(46.01,45.96)
  Bottom Layer w0.152: v1(43.09,45.83) 43.22,45.96 v1(46.01,45.96) ; v1(38.94,45.41) 38.77,45.25 38.77,45.2 37.25,46.72 37.25,47.77 37.19,47.83 37.19,48.27 37.25,48.34 v1(37.25,49.9)
LED_STATUS: length 2.2
  Top Layer w0.152: 47.25,37.88 47.25,38.57 46.94,38.88 U5.17
MIC_CLK: length 64.6
  Top Layer w0.152: v1(17.05,48.12) 17.44,47.74 18.58,47.74 18.96,47.36 34.71,47.36 35.6,46.47 39.35,46.47 39.61,46.21 40.8,46.21 43.09,48.5 v1(43.09,48.75) ; v1(46.01,48.75) 46.14,48.63 46.14,48.5 46.26,48.37 46.26,48.24 46.9,47.6 46.9,46.57 47.15,46.32 47.15,45.45 47.03,45.32 47.03,45.3 46.9,45.17 46.9,43.44 47.03,43.31 47.03,42.02 47.53,41.51 48.55,41.51 49.62,40.44 49.62,40.08 U5.20 ; v1(9.31,41.77) 9.64,41.77 U8.4 10.67,42.6 10.67,41.96 10.73,41.89 v1(12.7,41.89) ; U7.16 7.11,47.43 7.14,47.46 7.16,47.46 7.37,47.67 v1(7.87,47.67)
  Bottom Layer w0.152: v1(17.05,48.12) 16.29,47.36 16.29,46.84 16.32,46.81 16.32,46.37 16.29,46.35 16.29,45.2 12.99,41.89 v1(12.7,41.89) ; v1(7.87,47.67) 9.63,47.67 10.32,46.97 10.32,42.78 v1(9.31,41.77) ; v1(46.01,48.75) v1(43.09,48.75)
MIC_DATA: length 48.5
  Top Layer w0.152: v1(15.78,46.59) 13.56,44.37 v1(12.45,44.37) U8.1 ; v1(46.01,47.74) 46.14,47.74 46.65,47.23 46.65,46.47 46.9,46.21 46.9,45.58 46.65,45.32 46.65,41.51 47.03,41.13 47.79,41.13 48.64,40.28 U5.19 ; v1(15.78,48.12) 15.78,47.86 16.04,47.61 16.81,47.61 16.94,47.48 18.43,47.48 18.81,47.1 34.56,47.1 35.45,46.21 39.25,46.21 39.5,45.96 40.91,45.96 42.69,47.74 v1(43.09,47.74)
  Bottom Layer w0.152: v1(15.78,48.12) v1(15.78,46.59) ; v1(46.01,47.74) v1(43.09,47.74)
MIC_SELECT: length 65
  Top Layer w0.152: v1(46.14,49.64) 46.52,49.26 46.52,49 46.54,48.97 46.54,48.53 46.52,48.51 46.52,48.34 47.15,47.71 47.15,46.68 47.41,46.42 47.41,45.35 47.28,45.22 47.28,45.2 47.15,45.07 47.15,43.55 50.22,40.48 50.22,40.08 U5.21 ; v1(12.45,43.48) 10.92,43.48 10.57,43.83 U8.2 10.9,44.71 10.9,44.83 11.14,45.07 12.41,45.07 12.42,45.07 12.74,45.07 12.99,45.32 12.99,46.34 12.48,46.85 11.38,46.85 11.29,46.94 10.85,46.94 10.76,46.85 8.42,46.85 7.97,46.4 7.14,46.4 7.11,46.43 U7.14 ; v1(41.57,49.01) 35.9,49.01 34.63,47.74 19.01,47.74 18.63,48.12 18.07,48.12 17.56,48.63 17.3,48.63 16.92,49.01 v1(15.4,49.01)
  Bottom Layer w0.152: v1(12.45,43.48) 12.51,43.55 13.37,43.55 14.01,44.18 14.01,48.63 14.39,49.01 v1(15.4,49.01) ; v1(41.57,49.01) 41.82,49.26 42.84,49.26 42.87,49.29 43.31,49.29 43.34,49.26 45.76,49.26 v1(46.14,49.64)
MISO: length 10.1
  Top Layer w0.152: U12.2 57.03,32.41 56.13,33.31 56.13,35.62 54.16,37.59 54.16,37.91 53.74,38.33 U5.25
MOSI: length 14.4
  Top Layer w0.152: v1(51.24,37.95) 51.24,35.99 U12.5 ; 45.07,41.03 43.99,41.03 43.67,40.71 43.67,39.48 44.44,38.72 v1(45.63,38.72)
  Bottom Layer w0.152: v1(51.24,37.95) 50.46,37.95 49.83,38.59 45.76,38.59 v1(45.63,38.72)
RESET: length 38.6
  Top Layer w0.152: U5.45 58.97,52.88 v1(57.91,52.88) ; C15.1 30.92,57.49 v1(31.41,57.01) 31.5,56.92 R21.1 ; C15.1 29.02,57.49 28.32,58.19 SW1.2 ; C15.1 30.42,57.55 TP5.1 31.77,59.01 C42.2
  Bottom Layer w0.152: v1(31.41,57.01) 31.41,55.1 32.42,54.09 36.13,54.09 v1(36.32,53.9) 57.02,53.9 57.91,53.01 v1(57.91,52.88)
RX: length 2.4
  Top Layer w0.152: U5.39 57.73,47.82 v1(57.69,47.79)
  Bottom Layer w0.152: v1(57.69,47.79) 56.68,47.79 56.63,47.74
SCL: length 44.5
  Top Layer w0.152: U5.31 55.82,41.03 v1(55.76,41.08) ; v1(52.56,8.16) 52.77,7.96 52.77,7.55 53.02,7.3 53.02,7.21 53.09,7.14 U9.7
  Bottom Layer w0.152: v1(52.56,8.16) 53.68,8.16 55.61,10.09 55.61,14.31 52.61,17.31 52.61,27.06 55.48,29.93 55.48,36.07 55.66,36.26 55.66,40.98 v1(55.76,41.08) 57.21,41.08 R18.1
SD_CS: length 25.5
  Top Layer w0.152: v1(47.92,44.56) 48.04,44.56 48.17,44.43 50.2,44.43 52.33,42.3 v1(52.33,42.06) ; 45.07,45.28 44.99,45.2 v1(44.23,45.2) ; U12.1 58.83,31.14 59.1,31.42 59.1,32.74 58.74,33.1 57.61,33.1 56.6,34.11 56.6,35.7 54.6,37.71 54.6,38.52 v1(54.36,38.76)
  Bottom Layer w0.152: v1(54.36,38.76) 54.36,40.04 v1(52.33,42.06) ; v1(47.92,44.56) 46.26,44.56 45.63,45.2 v1(44.23,45.2)
SD_SCK: length 7.2
  Top Layer w0.152: U12.6 51.81,35.29 51.81,38.4 51.19,39.02 U5.22
SDA: length 44.2
  Top Layer w0.152: U9.8 52.59,6.87 v1(52.01,7.45) ; U5.32 59,41.89 v1(56.48,41.89)
  Bottom Layer w0.152: 52.01,7.94 v1(52.01,7.45) ; 52.01,7.94 52.01,8.36 ; 52.01,7.94 52.03,8.04 ; R17.1 56.55,41.97 v1(56.48,41.89) 55.82,41.89 55.13,41.2 v1(55.13,38.03) 54.98,37.87 54.98,30.14 52.11,27.26 52.11,17.16 54.74,14.52 54.77,14.52 55.11,14.17 55.11,11.47 52.01,8.36 ; 52.01,8.36 52.01,8.38 ; 52.03,8.04 52.03,8.23
SLC_VCC: length 85
  Top Layer w0.152: v1(6.1,23.29) 6.1,22.96 6.34,22.71 ; TP6.1 v1(53.38,1.76)
  Top Layer w0.254: U4.5 16.47,8.3 15.57,8.3 15.24,8.63 14.17,8.63 14.1,8.56 12.7,8.56 12.19,8.05 v1(12.19,7.03)
  Bottom Layer w0.152: v1(12.48,1.51) 13.24,2.27 v1(13.24,4.43) v1(13.24,5.57) 13.24,6.84 v1(13.12,6.97) 12.99,7.1 v1(11.47,7.1) ; v1(12.19,7.03) 12.28,6.94 v1(12.28,5.19) v1(11.47,5.19) ; v1(9.65,21) 9.65,22.65 8.89,23.42 6.22,23.42 v1(6.1,23.29)
  Bottom Layer w0.4: v1(10.38,20.24) 10.38,19.39 v1(11.3,18.46)
  Bottom Layer w0.6: v1(11.3,18.46) 11.3,17.67 14.13,14.84 14.13,13.45 11.47,10.78 v1(11.47,7.1)
  Bottom Layer w0.7: v1(12.48,1.51) 12.48,1.25 13.09,0.65 20.26,0.65 23.53,3.92 26.33,3.92 28.48,1.76 31.66,1.76 33.66,3.76 ; 33.77,3.85 35.75,3.85 38.95,0.65 53.15,0.65 53.38,0.87 v1(53.38,1)
  vias: v1(9.65,20.24) v1(10.38,21) v1(52.49,3.41) v1(52.49,2.66) v1(53.25,3.41) v1(53.24,2.66)
SPKR_DIN: length 50.3
  Top Layer w0.152: v1(43.09,46.97) 42.33,46.97 41.06,45.7 39.4,45.7 39.14,45.96 35.34,45.96 34.45,46.85 18.71,46.85 18.32,47.23 15.78,47.23 14.64,48.37 7.43,48.37 v1(7.37,48.43) 7.11,48.18 U7.1 ; U5.18 47.79,40.49 47.41,40.88 46.77,40.88 46.35,41.3 46.35,45.41 46.65,45.7 46.65,46.09 46.01,46.72 v1(46.01,46.97)
  Bottom Layer w0.152: v1(46.01,46.97) v1(43.09,46.97)
TOUCH_EXTERNAL: length 30.2
  Top Layer w0.152: v1(56.22,37.9) 56.22,39.88 U5.28 ; v1(56.05,29.93) 53.81,29.93 51.29,27.42 51.29,26.19 43.78,18.67 43.78,16.94 U10.1
  Bottom Layer w0.152: v1(56.05,29.93) 56.22,30.11 v1(56.22,37.9)
TOUCH_EXTERNAL_PIN: length 9.1
  Top Layer w0.152: v1(43.22,18.27) 40.8,20.69 H2.1 ; v1(40.42,15.22) 40.42,15.17 R24.2
  Bottom Layer w0.152: v1(43.22,18.27) 42.96,18.27 40.42,15.73 v1(40.42,15.22)
TX: length 2.8
  Top Layer w0.152: U5.40 57.74,48.68 v1(57.72,48.7)
  Bottom Layer w0.152: 56.58,49.21 56.58,48.91 56.79,48.7 v1(57.72,48.7)
$1N5324: length 1.7
  Top Layer w0.152: U10.4 46.01,13.84 45.34,13.17
$1N5325: length 3.2
  Top Layer w0.152: 44.25,13.17 44.25,13.64 U10.3 43.23,14.49 41.96,14.49
$1N5342: length 1.8
  Top Layer w0.152: 4.68,49.82 4.68,49.39 4.32,49.02 U7.4
$1N5353: length 20.4
  Top Layer w0.152: 4.82,45.18 v1(4.82,44.51) 4.46,44.16 4.46,43.81
  Top Layer w0.4: v1(2.92,43.48) 1.91,43.48 1.14,42.72 1.14,38.78 2.95,36.98 H1.2
  Bottom Layer w0.152: v1(4.82,44.51) 3.95,44.51 v1(2.92,43.48)
$1N5354: length 16.1
  Top Layer w0.152: U7.9 4.32,44.88 3.56,44.12 3.56,42.72 4.37,42.72 4.5,42.59
  Top Layer w0.4: 3.56,42.72 3.17,42.72 2.92,42.47 2.92,39.42 3.81,38.53 10.48,38.53 H1.1
$1N5410: length 1.5
  Top Layer w0.254: U3.5 54.73,23.48 54.03,24.18
$1N5412: length 1.5
  Top Layer w0.254: LED5.1 52.58,22.5 52.58,21.06
$1N5413: length 1.7
  Top Layer w0.152: U3.1 55.08,21.02 R38.2
$1N5423: length 1.9
  Top Layer w0.152: L1.2 5.04,20.45 5.4,20.81 6.34,20.81
$1N5430: length 4.7
  Top Layer w0.254: 17.14,7.92 17.14,3.74 16.75,3.35
$1N5458: length 13
  Top Layer w0.152: v1(47.71,32.24) 47.71,32.92 v1(49.1,34.31)
  Bottom Layer w0.152: v1(47.71,32.24) 47.71,30.88 48.08,30.5 49.31,30.5 49.97,29.83 49.97,29.81 50.2,29.58 50.2,29.1 LED19.1 ; v1(49.1,34.31) 49.14,34.27 49.57,34.27 49.97,34.68 49.97,35.64 49.73,35.88 49.73,36.14 49.63,36.14 48.93,36.84 48.93,37.4 49.34,37.81
$1N5459: length 13.2
  Top Layer w0.152: v1(50.21,38.97) 50.2,38.96 50.2,36.28 v1(49.24,35.32)
  Bottom Layer w0.152: v1(50.21,38.97) 50.21,41.25 v1(49.69,41.77) 47.43,44.03 LED17.3 ; LED18.1 49.02,35.32 v1(49.24,35.32)
$1N5464: length 9.7
  Bottom Layer w0.152: LED17.1 43.67,42.08 42.84,42.91 42.84,45.07 41.31,46.59 41.31,48.12 40.96,48.47 LED15.3
$1N5465: length 10.5
  Top Layer w0.152: v1(36.61,47.36) 37.19,47.93 37.19,48.27 37.5,48.59 37.94,48.59 38.05,48.47 v1(38.64,48.47)
  Bottom Layer w0.152: v1(36.61,47.36) 36.1,47.36 34.19,49.27 34.19,49.87 33.53,50.54 LED14.3 ; LED15.1 38.88,46.73 39.05,46.9 39.05,47.66 39.03,47.68 39.03,48.09 v1(38.64,48.47)
$1N5470: length 7.1
  Bottom Layer w0.152: LED14.1 31.68,48.37 29.25,48.37 27.65,49.97 25.49,49.97
$1N5471: length 6.7
  Bottom Layer w0.152: LED12.3 19.51,47.42 20.57,47.42 21.21,46.78 23.39,46.78 LED13.1
$1N5476: length 5.5
  Bottom Layer w0.152: LED12.1 14.71,41.54 13.9,41.54
$1N5477: length 5.6
  Bottom Layer w0.152: LED10.3 11.11,37.67 LED11.1
$1N5482: length 5.6
  Bottom Layer w0.152: LED10.1 10.24,28.2 LED9.3
$1N5483: length 5.8
  Bottom Layer w0.152: LED8.3 12.57,23.92 LED9.1
$1N5488: length 7.5
  Bottom Layer w0.152: LED8.1 12.95,18.21 15.75,18.34 17.83,15.61
$1N5489: length 7.9
  Top Layer w0.152: v1(21.12,13.6) v1(18.2,13.6)
  Bottom Layer w0.152: v1(21.12,13.6) 23.24,13.6 23.8,13.04 24.18,13.04 LED6.3 ; v1(18.2,13.6) 17.02,13.6 LED7.1
$1N5494: length 8.3
  Bottom Layer w0.152: LED4.3 26.77,11.95 25.58,10.76 LED6.1
$1N5495: length 10.1
  Bottom Layer w0.152: LED4.1 33.78,10.08 34.8,11.73 35.18,12.88 37.21,13.89 LED3.3
$1N5500: length 11.8
  Bottom Layer w0.152: LED2.3 43.34,16.72 42.86,17.01 41.07,15.4 41.78,13.13 38.61,10.59 LED3.1
$1N5501: length 14.8
  Bottom Layer w0.152: LED2.1 43.75,14.53 44.24,14.13 47.78,17.34 47.78,18.54 45.47,20.62 46.1,22.15 46.35,22.23 arc(46.38,22.26) 46.42,22.29 46.43,22.29 47.15,22.8 47.15,22.81 arc(47.42,22.86) 47.64,22.72 47.67,22.68 LED1.3
$1N5535: length 2.6
  Top Layer w0.4: v1(48.64,20.11) DO1.1
  Bottom Layer w0.4: LED1.1 v1(48.64,20.11)
$1N5565: length 11.7
  Top Layer w0.3: 32.25,7.1 32.3,7.15 32.31,7.16 ; 31.98,6.09 32.19,6.29 32.19,6.39 32.2,6.4 32.2,7.05
  Top Layer w0.4: v1(31.93,5) 31.8,5 31.77,5.03 v1(31.77,5.88) 31.98,6.09 ; v1(27.88,5.57) 27.88,6.25 27.75,6.38 27.75,7.1
  Top Layer w0.5: D7.2 33.87,8.36 33.63,8.11 32.65,8.11 32.3,7.76 32.3,7.1
  Bottom Layer w0.152: D6.2 32.37,5 v1(31.93,5)
  Bottom Layer w0.4: v1(27.88,5.57) 28.45,5 v1(28.58,5) v1(31.93,5)
$1N19227: length 1.7
  Top Layer w0.152: 28.94,50.66 LED21.2
$1N19266: length 1.2
  Top Layer w0.152: 48.12,37.88 48.13,37.87 LED16.2
$1N28187: length 1.6
  Top Layer w0.152: v1(51.04,32.95) 50.74,32.95 U12.7
  Bottom Layer w0.152: 51.63,32.95 v1(51.04,32.95)
$1N31093: length 4.4
  Top Layer w0.152: U12.3 59.2,34.68 v1(59.2,36.57)
  Bottom Layer w0.152: v1(59.2,36.57) 58.77,37 R42.2

## Copper pours and planes (outline as drawn; the poured copper is in the pictures)
3V3 on Top Layer: 3.17,26.21 3.17,23.08 3.43,22.82 3.43,21.37 3.81,20.99 3.81,18.97 3.56,18.72 0.64,18.72 0.38,18.97 0.38,26.08 0.51,26.21
3V3 on Top Layer: 45.21,18.46 46.61,18.46 46.61,15.29 45.21,15.29
3V3 on Top Layer: 3.93,45.69 3.07,45.69 3.06,45.68 2.86,45.89 2.75,45.89 2.72,45.92 1.21,45.92 0.92,46.2 0.92,48.39 2.86,48.39 2.91,48.34 2.91,46.7 3.06,46.55 3.83,46.55 3.93,46.45
3V3 on Top Layer: 44.29,50.84 43.72,50.27 43.62,50.27 42.93,49.58 37.88,49.58 37.5,49.96 37.5,51.35 37.76,51.6 44,51.6 45.5,51.45 45.5,50.84
3V3 on Bottom Layer: 3.17,26.21 3.17,23.08 3.43,22.82 3.43,21.37 3.81,20.99 3.81,18.97 3.56,18.72 0.64,18.72 0.38,18.97 0.38,26.08 0.51,26.21
3V3 on Inner2: 0.26,59.74 59.74,59.74 59.74,0.26 0.26,0.26
+5V on Top Layer: 16.89,11.22 22.35,11.22 22.35,8.43 16.89,8.43
+5V on Top Layer: 15.63,11.23 17.24,11.23 17.24,10.21 15.63,10.21
GND on Top Layer: 43.83,54.41 59.74,54.41 59.74,53.47 43.83,53.47
GND on Top Layer: 17.65,7.67 22.35,7.67 22.35,0.68 17.65,0.68
GND on Top Layer: 44.15,18.95 45.1,18.95 45.1,15.25 44.15,15.25
GND on Top Layer: 42.64,15.98 44.7,15.98 44.7,15.22 42.64,15.22
GND on Top Layer: 56.57,20.55 56.28,20.26 56.01,20.26 56.01,17.14 55.74,16.87 51.49,16.87 51.49,20.17 51.62,20.3 55.68,20.3 55.81,20.43 55.81,24.25 54.78,24.25 54.41,24.62 53.46,24.62 53.46,27.85 53.78,28.17 55.81,28.17 55.94,28.05 55.94,24.72 56.57,24.08
GND on Top Layer: 46.73,12.38 47.12,11.99 51.97,11.99 52.65,11.31 52.65,9.62 52.75,9.52 49.74,9.52 49.54,9.73 49.13,9.73 48.72,10.13 46.79,10.13 46.68,10.03 45.97,10.75 45.97,12.17 46.17,12.38
GND on Top Layer: 10.53,45.93 10.53,45.19 9.95,44.61 9.95,44.46 10.03,44.38 10.03,44.06 10.2,43.89 10.2,43.14 9.58,42.52 6.63,42.52 6.32,42.22 5.2,42.22 5.15,42.27 5.15,44.79 5.1,45.48 5.15,45.53 5.46,45.53 5.51,45.48 5.51,44.76 5.72,44.55 7.23,44.55 8.87,46.19 10.27,46.19
GND on Top Layer: 7.11,20.11 6.98,19.99 6.09,19.99 6.09,18.97 5.59,18.46 2.29,18.46 2.16,18.34 2.16,15.92 2.29,15.8 13.33,15.8 13.46,15.92 13.46,17.57 13.33,17.7 8.64,17.7 8.51,17.83 8.51,19.43 7.87,20.06 7.87,23.54 8,23.67 8,26.21 7.87,26.34 3.67,26.34 3.67,23.92 3.92,23.67 3.92,21.63 4.17,21.38 6.98,21.38 6.98,22.15 5.46,22.15 5.46,23.67 5.59,23.8 6.98,23.8 7.11,23.67
GND on Top Layer: 49.41,49.59 54.75,49.59 54.75,44.54 49.41,44.54
GND on Top Layer: 13.08,11.73 15.42,11.73 15.42,10.21 13.08,10.21
GND on Top Layer: 36.83,51.99 44.12,51.99 44.34,51.76 45.87,51.76 45.97,51.86 45.97,54.02 45.72,54.28 36.96,54.28 36.83,54.15
GND on Top Layer: 0.89,50.97 4.06,50.97 4.06,48.69 0.89,48.69
GND on Top Layer: 25.4,10.46 28.96,10.46 28.96,9.06 25.4,9.06
GND on Bottom Layer: 46.73,12.38 47.12,11.99 51.97,11.99 52.65,11.31 52.65,9.62 52.75,9.52 49.74,9.52 49.54,9.73 49.13,9.73 48.72,10.13 46.79,10.13 46.68,10.03 45.97,10.75 45.97,12.17 46.17,12.38
GND on Bottom Layer: 7.05,20.18 6.92,20.05 6.03,20.05 6.03,19.03 5.52,18.53 2.22,18.53 2.1,18.4 2.1,15.99 2.22,15.86 13.27,15.86 13.4,15.99 13.4,17.64 13.27,17.76 8.57,17.76 8.45,17.89 8.45,19.49 7.81,20.12 7.81,23.61 7.94,23.73 7.94,26.27 7.81,26.4 3.61,26.4 3.61,23.99 3.86,23.73 3.86,21.69 4.1,21.45 6.92,21.45 6.92,22.21 5.4,22.21 5.4,23.73 5.52,23.86 6.92,23.86 7.05,23.73
GND on Inner1: 0.26,59.74 59.74,59.74 59.74,0.26 0.26,0.26
VBAT on Top Layer: 47.12,12.37 52.14,12.37 52.52,11.99 53.85,11.99 54.74,12.88 54.74,14.02 54.61,14.14 52.83,14.14 51.99,14.99 48.67,14.99 47.58,13.89 47.12,13.89
VBAT on Top Layer: 56.82,20.17 56.54,19.89 56.54,17.06 56.68,16.92 59.16,16.92 59.36,17.12 59.36,22.33 56.82,22.33
VBAT on Bottom Layer: 47.12,14.99 54.74,14.99 54.74,11.99 47.12,11.99
VBUS on Top Layer: 56.82,22.84 56.82,24.24 56.31,24.75 56.29,24.75 56.29,27.89 56.44,28.05 59.11,28.05 59.36,27.79 59.36,23.09 59.11,22.84
VBUS on Top Layer: 48.02,3.5 50.27,3.5 50.27,0.45 48.02,0.45
SLC_VCC on Top Layer: 11.18,7.41 16.85,7.41 16.85,6.14 11.18,6.14
SLC_VCC on Top Layer: 8,20.37 8.89,19.48 8.89,18.04 11.8,18.04 11.8,21.41 8.2,21.41 8.2,21.2 8,21
SLC_VCC on Top Layer: 51.05,3.86 53.59,3.86 53.59,0.43 51.05,0.43
SLC_VCC on Top Layer: 11.18,7.41 13.59,7.41 13.59,0.56 11.18,0.56
SLC_VCC on Bottom Layer: 8.13,21 8.13,20.24 8.89,19.48 8.89,18.04 11.65,18.04 11.68,18.08 11.68,18.59 10.73,19.54 10.73,21.32 10.67,21.38 8.38,21.38 8.26,21.26 8.26,21.13
SLC_VCC on Bottom Layer: 11.21,7.35 13.5,7.35 13.5,0.62 11.21,0.62
TOUCH_EXTERNAL_PIN on Bottom Layer: 14,46 46,46 46,14 14,14
$1N5430 on Top Layer: 17.27,4.87 15.36,4.87 15.37,4.88 15.37,5.13 16.95,5.93 17.02,5.95 17.02,8.18 17.27,8.18
$1N5430 on Top Layer: 15.37,5.13 17.4,5.13 17.4,0.68 15.37,0.68
$1N5433 on Top Layer: 14.33,9.98 16.81,9.98 16.81,8.63 14.33,8.63
$1N5564 on Top Layer: 8.13,23.16 8.35,23.16 8.35,25.29 8.38,25.32 10.8,25.32 10.92,25.2 10.92,22.22 10.46,21.76 8.34,21.76 8.13,21.98
$1N9143 on Bottom Layer: 8.13,23.16 8.35,23.16 8.35,25.29 8.38,25.32 10.8,25.32 10.92,25.2 10.92,22.22 10.46,21.76 8.34,21.76 8.13,21.98

Small or netless copper shapes (teardrops, artwork), in the pictures only: 16 on Inner1

## Text on the board
Bottom Silkscreen Layer: TOUCH | RX | TX | MIC
Top Silkscreen Layer: USB | V2 / Designed by Shoaib Mustafa / shoaib@capistor.com / www.capistor.com | PWR | STATUS | CHG | 3V3 | EXT TOUCH | VBAT | GND | 5V | LED OUT | SPKR | BOOT | RESET | + | -- | BAT | -
